# Altium project Artus Flex PCB - Revision 1.PrjPCB
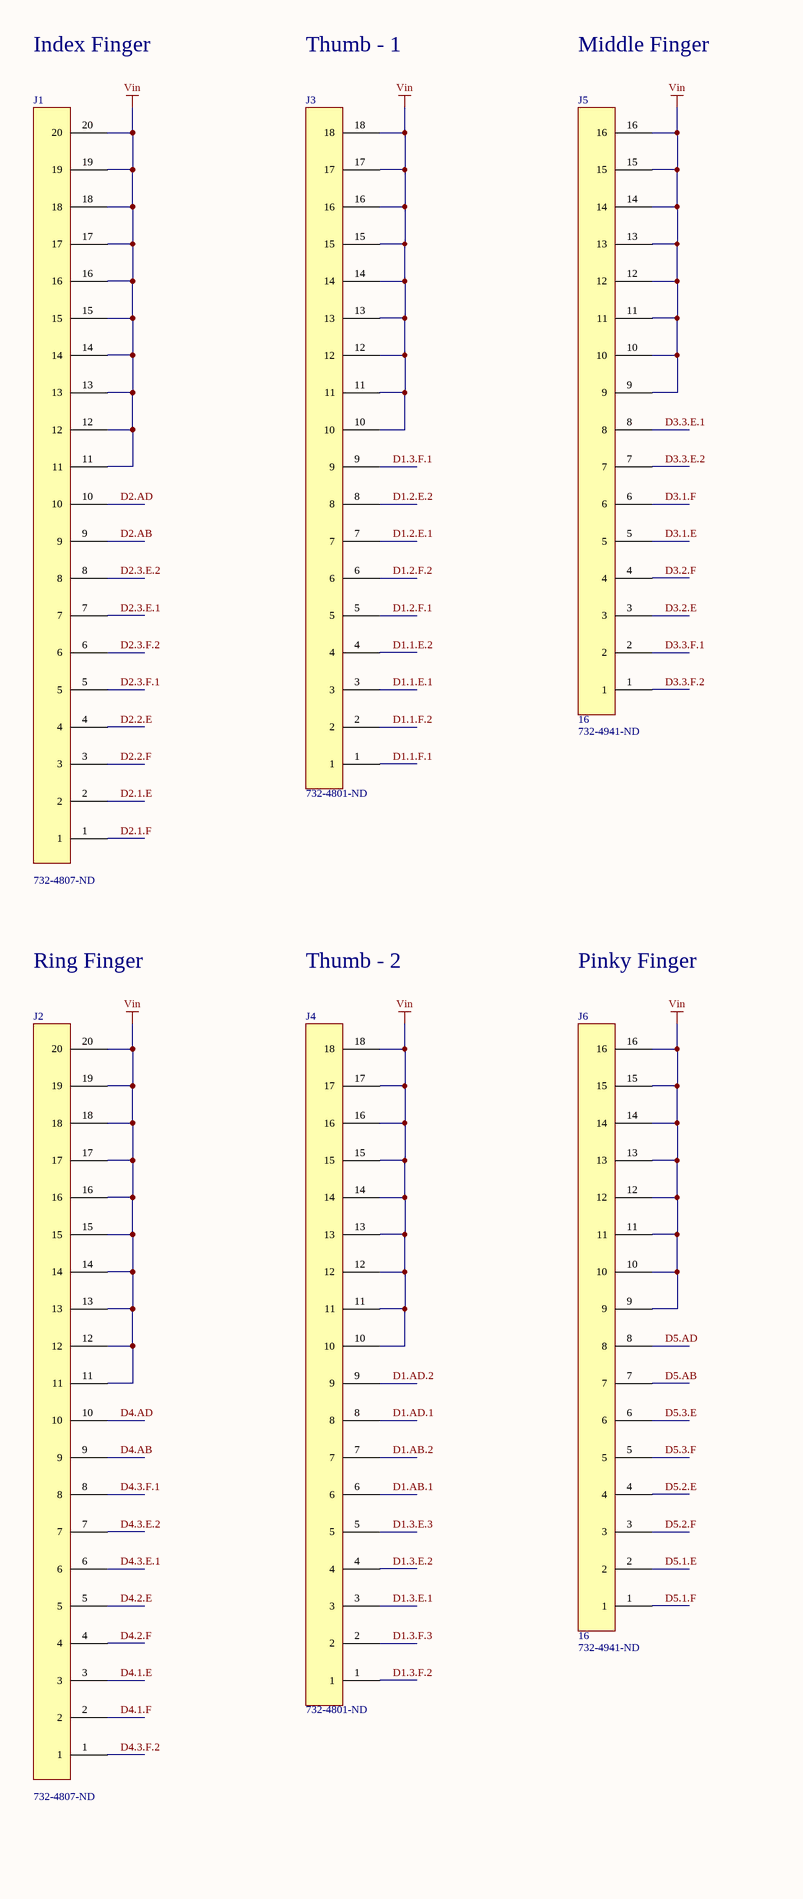
[diagram p0: FLEX_MCU_CONFIG.SchDoc, left]
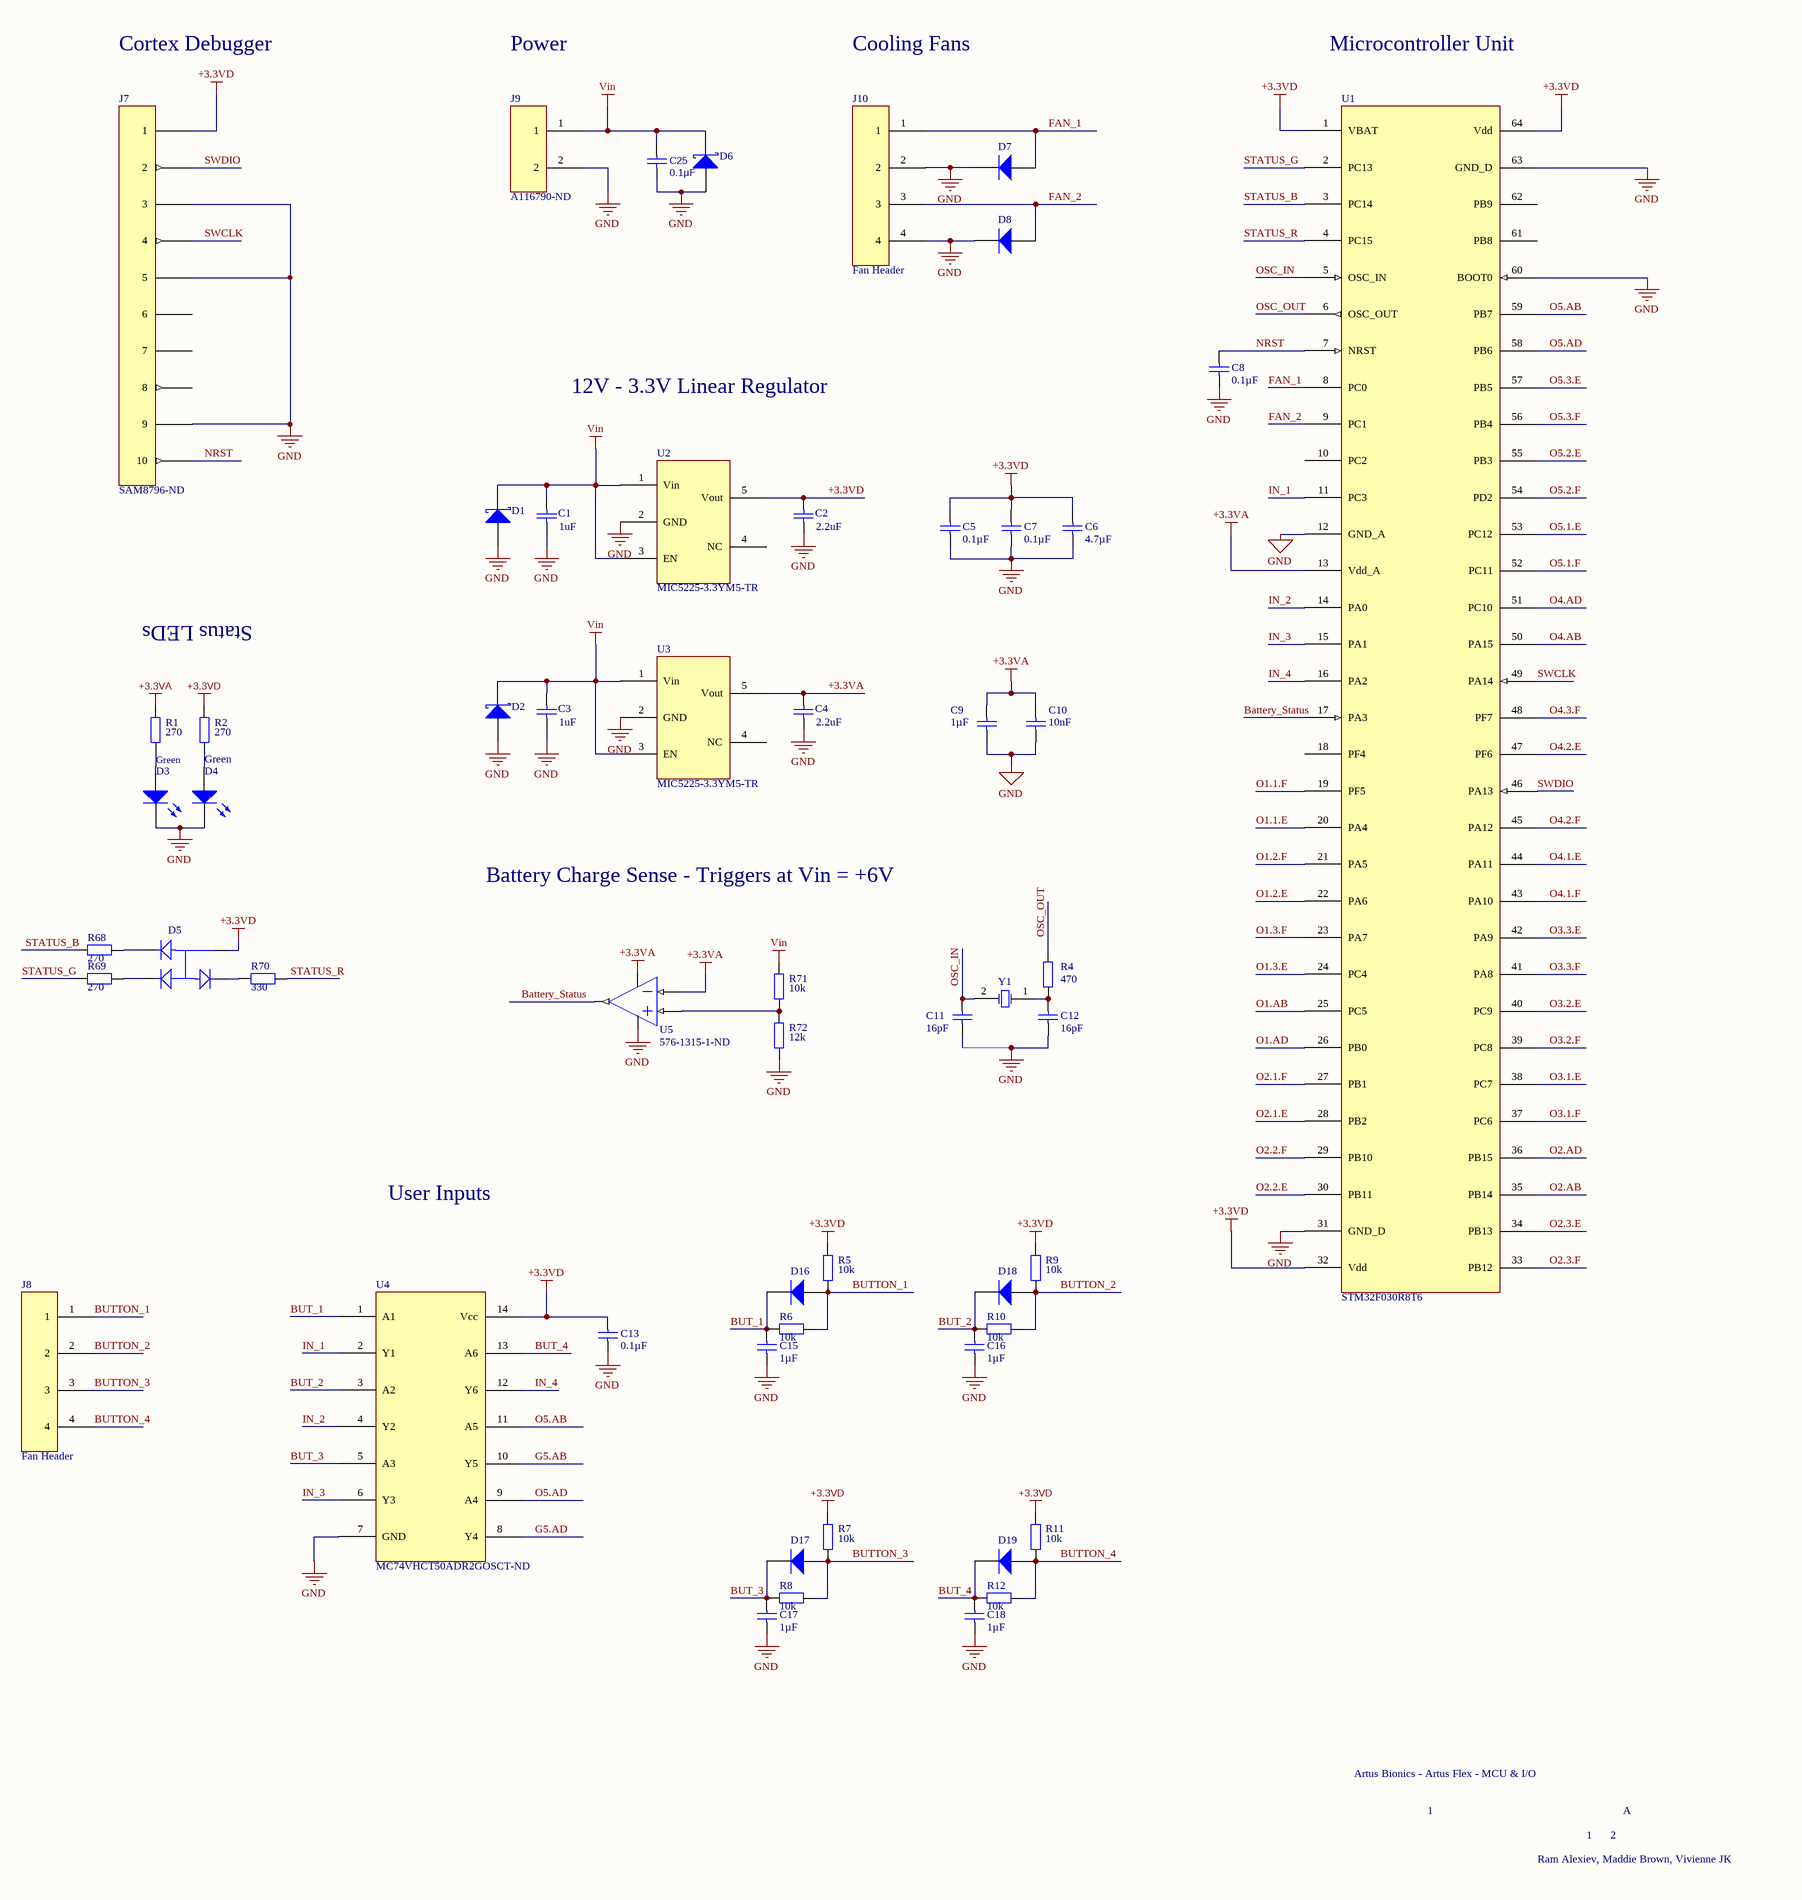
[diagram p1: FLEX_MCU_CONFIG.SchDoc, right]
2 sheets, 236 parts. Net scope: global (net labels, ports and power ports of the same name join across sheets).
Board file: PCB Layout.PcbDoc
Sheets:
  FLEX_MCU_CONFIG.SchDoc
  FLEX_OUTPUT.SchDoc

## Sheet FLEX_MCU_CONFIG.SchDoc
size A2; PageSetup: Record=PageOptions|CenterHorizontal=True|CenterVertical=True|PrintScale=0.69|XCorrection=1.00|YCorrection=1.00|PrintKind=0|BorderSize=5000000|LeftOffset=0|BottomOffset=0|Orientation=2|PaperLength=1000|PaperWidth=1000|Scale=100|PaperSource=7|PrintQuality=-3|MediaType=1|DitherType=10|PrintScaleMode=1|PaperKind=Tabloid|PaperIndex=3

### Parts
C1  value 1uF  [TDK C-Series (1608)]
C2  value 2.2uF  [TDK C-Series (1608)]
C3  value 1uF  [TDK C-Series (1608)]
C4  value 2.2uF  [TDK C-Series (1608)]
C5  value 0.1µF  [TDK C-Series (1608)]
C6  value 4.7µF  [TDK C-Series (1608)]  (hidden comment: Cap)
C7  value 0.1µF  [TDK C-Series (1608)]
C8  value 0.1µF  [TDK C-Series (1608)]
C9  value 1µF  [TDK C-Series (1608)]
C10  value 10nF  [TDK C-Series (1608)]
C11  value 16pF  [Johanson S-Series (1608)]
C12  value 16pF  [Johanson S-Series (1608)]
C13  value 0.1µF  [TDK C-Series (1608)]  (hidden comment: Cap)
C15  value 1µF  [TDK C-Series (1608)]  (hidden comment: Cap)
C16  value 1µF  [TDK C-Series (1608)]  (hidden comment: Cap)
C17  value 1µF  [TDK C-Series (1608)]  (hidden comment: Cap)
C18  value 1µF  [TDK C-Series (1608)]  (hidden comment: Cap)
C25  value 0.1µF  [TDK C-Series (1608)]
D1  (no value)  [Diode_TVS]
D2  (no value)  [Diode_TVS]
D3  LTST-C193KGKT-5A  [Lite-On LTST-C193K-Series (1608)]  (value not drawn)
D4  LTST-C193KGKT-5A  [Lite-On LTST-C193K-Series (1608)]  (value not drawn)
D5  Cree CLVBA-FKA-CAEDH8BBB7A363  [Cree CLVBA-FKA-Series (4-SOJ)]  (value not drawn)
D6  Diode BAT17  [Diode_TVS]  (value not drawn)
D7  Diode 1N4006  [Diode_Shottky]  (value not drawn)
D8  Diode 1N4006  [Diode_Shottky]  (value not drawn)
D16  de  [Diode_Shottky]  (value not drawn)
D17  de  [Diode_Shottky]  (value not drawn)
D18  de  [Diode_Shottky]  (value not drawn)
D19  de  [Diode_Shottky]  (value not drawn)
J1  Supplier Part Number 1: 732-4807-ND  [20PIN_UP_CONNECTOR]  (hidden comment: 20 Pin Header)
J2  Supplier Part Number 1: 732-4807-ND  [20PIN_UP_CONNECTOR]  (hidden comment: 20 Pin Header)
J3  Supplier Part Number 1: 732-4801-ND  [18PIN_UP_CONNECTOR]  (hidden comment: 18 Pin Header)
J4  Supplier Part Number 1: 732-4801-ND  [18PIN_UP_CONNECTOR]  (hidden comment: 18 Pin Header)
J5  16  Supplier Part Number 1: 732-4941-ND
J6  16  Supplier Part Number 1: 732-4941-ND
J7  Supplier Part Number 2: SAM8796-ND  [Samtec FTSH-105-01-L-DV-K]  (hidden comment: Cortex Debugger)
J8  Fan Header
J9  Supplier Part Number 1: A116790-ND  [2PIN_TERMINAL_BLOCK]  (hidden comment: Power Header)
J10  Fan Header
R1  value 270  [Panasonic ERJ-Series (1608)]
R2  value 270  [Panasonic ERJ-Series (1608)]
R4  value 470  [Panasonic ERJ-Series (1608)]
R5  value 10k  [Panasonic ERJ-Series (1608)]
R6  value 10k  [Panasonic ERJ-Series (1608)]
R7  value 10k  [Panasonic ERJ-Series (1608)]
R8  value 10k  [Panasonic ERJ-Series (1608)]
R9  value 10k  [Panasonic ERJ-Series (1608)]
R10  value 10k  [Panasonic ERJ-Series (1608)]
R11  value 10k  [Panasonic ERJ-Series (1608)]
R12  value 10k  [Panasonic ERJ-Series (1608)]
R68  value 270  [Panasonic ERJ-Series (1608)]
R69  value 270  [Panasonic ERJ-Series (1608)]
R70  value 330  [Panasonic ERJ-Series (1608)]
R71  value 10k  [Panasonic ERJ-Series (1608)]
R72  value 12k  [Panasonic ERJ-Series (1608)]
U1  STM32F030R8T6
U2  MIC5225-3.3YM5-TR  [LINEAR REGULATOR SOT95P280X145-5N]
U3  MIC5225-3.3YM5-TR  [LINEAR REGULATOR SOT95P280X145-5N]
U4  Supplier Part Number 1: MC74VHCT50ADR2GOSCT-ND  (hidden comment: MC74VHCT50A)
U5  Supplier Part Number 1: 576-1315-1-ND  [LINEAR REGULATOR SOT95P280X145-5N]  (hidden comment: TSV991ILT)
Y1  (no value)  [Abracon ABM3-8.000MHZ-D2Y-T (2-DFN)]

### Nets
+3.3VA: C4.2 C9.2 C10.2 R1.2 U1.13(Vdd_A) U3.5(Vout) U5.2(VCC-) U5.4(IN-)
+3.3VD: C2.2 C5.2 C6.2 C7.2 C13.2 D5.2(COMMON_ANODE) J7.1 R2.2 R5.1 R7.1 R9.1 R11.1 U1.1(VBAT) U1.32(Vdd) U1.64(Vdd) U2.5(Vout) U4.14(Vcc)
GND: C1.1 C2.1 C3.1 C4.1 C5.1 C6.1 C7.1 C8.1 C9.1 C10.1 C11.2 C12.2 C13.1 C15.1 C16.1 C17.1 C18.1 C25.1 D1.3(A) D2.3(A) D3.2(K) D4.2(K) D6.1(A) D7.2(K) D8.2(K) J7.3 J7.5 J7.9 J9.2 J10.2 J10.4 R72.2 U1.12(GND_A) U1.31(GND_D) U1.60(BOOT0) U1.63(GND_D) U2.2(GND) U3.2(GND) U4.7(GND) U5.5(VCC+)
Vin: C1.2 C3.2 C25.2 D1.1(K) D2.1(K) D6.3(K) J1.11 J1.12 J1.13 J1.14 J1.15 J1.16 J1.17 J1.18 J1.19 J1.20 J2.11 J2.12 J2.13 J2.14 J2.15 J2.16 J2.17 J2.18 J2.19 J2.20 J3.10 J3.11 J3.12 J3.13 J3.14 J3.15 J3.16 J3.17 J3.18 J4.10 J4.11 J4.12 J4.13 J4.14 J4.15 J4.16 J4.17 J4.18 J5.9 J5.10 J5.11 J5.12 J5.13 J5.14 J5.15 J5.16 J6.9 J6.10 J6.11 J6.12 J6.13 J6.14 J6.15 J6.16 J9.1 R71.1 U2.1(Vin) U2.3(EN) U3.1(Vin) U3.3(EN)
Battery_Status: U1.17(PA3) U5.1(OUT)
BUT_1: C15.2 D16.2(K) R6.1 U4.1(A1)
BUT_2: C16.2 D18.2(K) R10.1 U4.3(A2)
BUT_3: C17.2 D17.2(K) R8.1 U4.5(A3)
BUT_4: C18.2 D19.2(K) R12.1 U4.13(A6)
BUTTON_1: D16.1(A) J8.1 R5.2 R6.2
BUTTON_2: D18.1(A) J8.2 R9.2 R10.2
BUTTON_3: D17.1(A) J8.3 R7.2 R8.2
BUTTON_4: D19.1(A) J8.4 R11.2 R12.2
D1.1.E.1: J3.3
D1.1.E.2: J3.4
D1.1.F.1: J3.1
D1.1.F.2: J3.2
D1.2.E.1: J3.7
D1.2.E.2: J3.8
D1.2.F.1: J3.5
D1.2.F.2: J3.6
D1.3.E.1: J4.3
D1.3.E.2: J4.4
D1.3.E.3: J4.5
D1.3.F.1: J3.9
D1.3.F.2: J4.1
D1.3.F.3: J4.2
D1.AB.1: J4.6
D1.AB.2: J4.7
D1.AD.1: J4.8
D1.AD.2: J4.9
D2.1.E: J1.2
D2.1.F: J1.1
D2.2.E: J1.4
D2.2.F: J1.3
D2.3.E.1: J1.7
D2.3.E.2: J1.8
D2.3.F.1: J1.5
D2.3.F.2: J1.6
D2.AB: J1.9
D2.AD: J1.10
D3.1.E: J5.5
D3.1.F: J5.6
D3.2.E: J5.3
D3.2.F: J5.4
D3.3.E.1: J5.8
D3.3.E.2: J5.7
D3.3.F.1: J5.2
D3.3.F.2: J5.1
D4.1.E: J2.3
D4.1.F: J2.2
D4.2.E: J2.5
D4.2.F: J2.4
D4.3.E.1: J2.6
D4.3.E.2: J2.7
D4.3.F.1: J2.8
D4.3.F.2: J2.1
D4.AB: J2.9
D4.AD: J2.10
D5.1.E: J6.2
D5.1.F: J6.1
D5.2.E: J6.4
D5.2.F: J6.3
D5.3.E: J6.6
D5.3.F: J6.5
D5.AB: J6.7
D5.AD: J6.8
FAN_1: D7.1(A) J10.1 U1.8(PC0)
FAN_2: D8.1(A) J10.3 U1.9(PC1)
G5.AB: U4.10(Y5)
G5.AD: U4.8(Y4)
IN_1: U1.11(PC3) U4.2(Y1)
IN_2: U1.14(PA0) U4.4(Y2)
IN_3: U1.15(PA1) U4.6(Y3)
IN_4: U1.16(PA2) U4.12(Y6)
NRST: C8.2 J7.10 U1.7(NRST)
O1.1.E: U1.20(PA4)
O1.1.F: U1.19(PF5)
O1.2.E: U1.22(PA6)
O1.2.F: U1.21(PA5)
O1.3.E: U1.24(PC4)
O1.3.F: U1.23(PA7)
O1.AB: U1.25(PC5)
O1.AD: U1.26(PB0)
O2.1.E: U1.28(PB2)
O2.1.F: U1.27(PB1)
O2.2.E: U1.30(PB11)
O2.2.F: U1.29(PB10)
O2.3.E: U1.34(PB13)
O2.3.F: U1.33(PB12)
O2.AB: U1.35(PB14)
O2.AD: U1.36(PB15)
O3.1.E: U1.38(PC7)
O3.1.F: U1.37(PC6)
O3.2.E: U1.40(PC9)
O3.2.F: U1.39(PC8)
O3.3.E: U1.42(PA9)
O3.3.F: U1.41(PA8)
O4.1.E: U1.44(PA11)
O4.1.F: U1.43(PA10)
O4.2.E: U1.47(PF6)
O4.2.F: U1.45(PA12)
O4.3.F: U1.48(PF7)
O4.AB: U1.50(PA15)
O4.AD: U1.51(PC10)
O5.1.E: U1.53(PC12)
O5.1.F: U1.52(PC11)
O5.2.E: U1.55(PB3)
O5.2.F: U1.54(PD2)
O5.3.E: U1.57(PB5)
O5.3.F: U1.56(PB4)
O5.AB: U1.59(PB7) U4.11(A5)
O5.AD: U1.58(PB6) U4.9(A4)
OSC_IN: C11.1 U1.5(OSC_IN) Y1.2(OSC2)
OSC_OUT: R4.2 U1.6(OSC_OUT)
STATUS_B: R68.1 U1.3(PC14)
STATUS_G: R69.1 U1.2(PC13)
STATUS_R: R70.2 U1.4(PC15)
SWCLK: J7.4 U1.49(PA14)
SWDIO: J7.66(2) U1.46(PA13)
NetC12_1: C12.1 R4.1 Y1.1(OSC1)
NetD3_1: D3.1(A) R1.1
NetD4_1: D4.1(A) R2.1
NetD5_1: D5.1(RED) R70.1
NetD5_3: D5.3(BLUE) R68.2
NetD5_4: D5.4(GREEN) R69.2
NetR71_2: R71.2 R72.1 U5.3(IN+)

Not connected (* = marked no-connect by the designer): J7 6 7 8; U1 10(PC2) 18(PF4) 61(PB8) 62(PB9); U2 4(NC); U3 4(NC)

### Notes on the sheet
- Index Finger
- Thumb - 1
- Middle Finger
- Cortex Debugger
- Power
- Cooling Fans
- Microcontroller Unit
- 12V - 3.3V Linear Regulator
- Status LEDs
- (near R1) Green
- (near R2) Green
- Battery Charge Sense - Triggers at Vin = +6V
- Ring Finger
- Thumb - 2
- Pinky Finger
- User Inputs
- Artus Bionics - Artus Flex - MCU & I/O
- 1
- 2
- A
- Ram Alexiev, Maddie Brown, Vivienne JK

### Library data of the parts
C1-C13 C15-C18 C25 = Cap: Capacitor; Published: 8-Jun-2000; LatestRevisionDate: 17-Jul-2002; LatestRevisionNote: Re-released for DXP Platform.; PackageReference: RAD-0.3; Publisher: Altium Limited; PackageDescription: Radial Cap, Thru-Hole; 2 Leads; 0.3 in Pin Spacing; Supplier 1: Digi-Key
  C1 C3: Supplier 2: Digi-Key; Supplier Part Number 2: 445-5146-1-ND
  C2 C4: Supplier 2: Digi-Key; Supplier Part Number 2: 445-5964-1-ND
  C5 C7 C8 C13 C25: Supplier Part Number 1: 445-1316-1-ND
  C6: Supplier Part Number 1: 445-7482-1-ND
  C9: Supplier Part Number 1: 445-5956-1-ND
  C10: Supplier Part Number 1: 445-1304-1-ND
  C11 C12: Supplier Part Number 1: 712-1320-1-ND
  C15-C18: Supplier Part Number 1: 445-5146-1-ND
D1 D2 = Diode 10TQ035: Schottky Rectifier; Note: Terminal 2 is the TAB and is electrically connected to the cathode; Published: 8-Jun-2000; LatestRevisionDate: 17-Jul-2002; LatestRevisionNote: Re-released for DXP Platform.; DatasheetVersion: PD-2.057B; PackageVersion: Feb-1998; PackageReference: TO-220AC; Publisher: Altium Limited; PackageDescription: TO, Thru-Hole, Vertical, Heatsink Mounted; 3 In-Line Leads (1 Absent); Pitch 2.54 mm; ComponentLink1Description: Manufacturer Link; ComponentLink1URL: http://www.irf.com/; ComponentLink2Description: Datasheet; ComponentLink2URL: http://www.irf.com/product-info/datasheets/data/10tq.pdf; Supplier 1: Digi-Key; Supplier 2: Digi-Key; Supplier Part Number 2: SMBJ8.0D-M3/HGICT-ND
D3 D4 = LED0: Typical INFRARED GaAs LED; Published: 8-Jun-2000; LatestRevisionDate: 08-Jul-2005; LatestRevisionNote: Mech Layer 1 removed.; PackageReference: LED-0; Publisher: Altium Limited; PackageDescription: LED; 2 Leads; Supplier 1: Digi-Key; Supplier Part Number 1: 160-1828-1-ND
D5 = Cree CLVBA-FKA-CAEDH8BBB7A363: RGB LED; Supplier 1: Digi-Key; Supplier Part Number 1: CLVBA-FKA-CAEDH8BBB7A363CT-ND
D6 = Diode BAT17: Silicon RF Schottky Diode for Mixer Applications in the VHF/UHF Range; Note: Pin 2 is not connected and not drawn.; Published: 21-Mar-2003; LatestRevisionDate: 29-May-2009; LatestRevisionNote: IPC-7351 Footprint Added.; DatasheetVersion: Oct-1999; PackageVersion: Sep-2001; PackageReference: SOT-23; Publisher: Altium Limited; PackageDescription: 3-Pin SOT-23 Package 0.95 mm Pitch, 2.5 mm Lead Span; ComponentLink1Description: Manufacturer Link; ComponentLink1URL: http://www.infineon.com/; ComponentLink2Description: Datasheet; ComponentLink2URL: http://www.infineon.com/upload/Document/cmc_upload/documents/009/363/bat17series.pdf; Supplier 1: Digi-Key; Supplier Part Number 1: DF2S10FSL3MCT-ND
D7 D8 = Diode 1N4006: 1 Amp General Purpose Rectifier; Published: 8-Jun-2000; LatestRevisionDate: 17-Jul-2002; LatestRevisionNote: Re-released for DXP Platform.; DatasheetVersion: 1998; PackageVersion: Aug-1999; PackageReference: DO-41; Publisher: Altium Limited; PackageDescription: Diode, Axial; Body 5.2 x 2.7 mm (LxDia. max), Lead Dia. 0.86 mm (max); Code_JEDEC: DO-204-AL; ComponentLink1Description: Manufacturer Link; ComponentLink1URL: http://www.fairchildsemi.com/; ComponentLink2Description: Datasheet; ComponentLink2URL: http://www.fairchildsemi.com/ds/1N%2F1N4001.pdf; Supplier 1: Digi-Key; Supplier Part Number 1: 1655-1502-1-ND
D16-D19 = Diode: Default Diode; Published: 8-Jun-2000; LatestRevisionDate: 17-Jul-2002; LatestRevisionNote: Re-released for DXP Platform.; PackageVersion: Sep-1996; PackageReference: SMC; Publisher: Altium Limited; PackageDescription: DO-214-AB/SMC; 2 C-Bend Leads; Body 7.9 x 5.9 mm, inc. leads (LxW); Code_JEDEC: DO-214-AB; Supplier 1: Digi-Key; Supplier Part Number 1: 1727-5384-1-ND
J1 J2 = 20 Pin Header: 20 position header; Supplier 1: Digi-Key
J3 J4 = 18 Pin Header: 18 Position Header; Supplier 1: Digi-Key
J5 J6 = 16: 16 Position header; Supplier 1: Digi-Key
J7 = Cortex Debugger: Header; Supplier 1: Digi-Key; Supplier 2: Digi-Key
R1 R2 R4-R12 R68-R72 = Res2: Resistor; Published: 8-Jun-2000; LatestRevisionDate: 17-Jul-2002; LatestRevisionNote: Re-released for DXP Platform.; PackageReference: AXIAL-0.4; Publisher: Altium Limited; PackageDescription: Axial Device, Thru-Hole; 2 Leads; 0.4 in Pin Spacing; Supplier 1: Digi-Key
  R1 R2 R68 R69: Supplier Part Number 1: P270HCT-ND
  R4: Supplier Part Number 1: P470HCT-ND
  R5-R12 R71: Supplier Part Number 1: P10.0KHCT-ND
  R70: Supplier Part Number 1: P330HCT-ND
  R72: Supplier Part Number 1: P12.0KHCT-ND
U1 = STM32F030R8T6: MCU; Supplier Part Number 1: 497-14045-ND; Supplier 1: Digi-Key
U2 U3 = MIC5225-3.3YM5-TR: 12V-3.3V Linear Regulator; Supplier 1: Digi-Key; Supplier Part Number 1: 576-2980-1-ND
U4 = MC74VHCT50A: 6-Channel CMOS Buffer; Supplier 1: Digi-Key
U5 = STMicroelectronics TSV991ILT: 20MHz Op-Amp; Supplier 1: Digi-Key
Y1 = XTAL: Crystal Oscillator; Published: 8-Jun-2000; LatestRevisionDate: 17-Jul-2002; LatestRevisionNote: Re-released for DXP Platform.; PackageReference: R38; Publisher: Altium Limited; PackageDescription: Crystal, Thru-Hole; 2 Leads; Body 3.1 x 8.2 mm (Dia.xH); Supplier 1: Digi-Key; Supplier Part Number 1: 535-10630-1-ND
J8 J10 = Fan Header: Supplier 1: Digi-Key; Supplier Part Number 1: A33201CT-ND
J9 = Power Header: Supplier 1: Digi-Key

## Sheet FLEX_OUTPUT.SchDoc
size A2; PageSetup: Record=PageOptions|CenterHorizontal=True|CenterVertical=True|PrintScale=0.52|XCorrection=1.00|YCorrection=1.00|PrintKind=0|BorderSize=5000000|LeftOffset=0|BottomOffset=0|Orientation=2|PaperLength=1000|PaperWidth=1000|Scale=100|PaperSource=7|PrintQuality=-3|MediaType=1|DitherType=10|PrintScaleMode=1|PaperKind=A4|PaperIndex=9
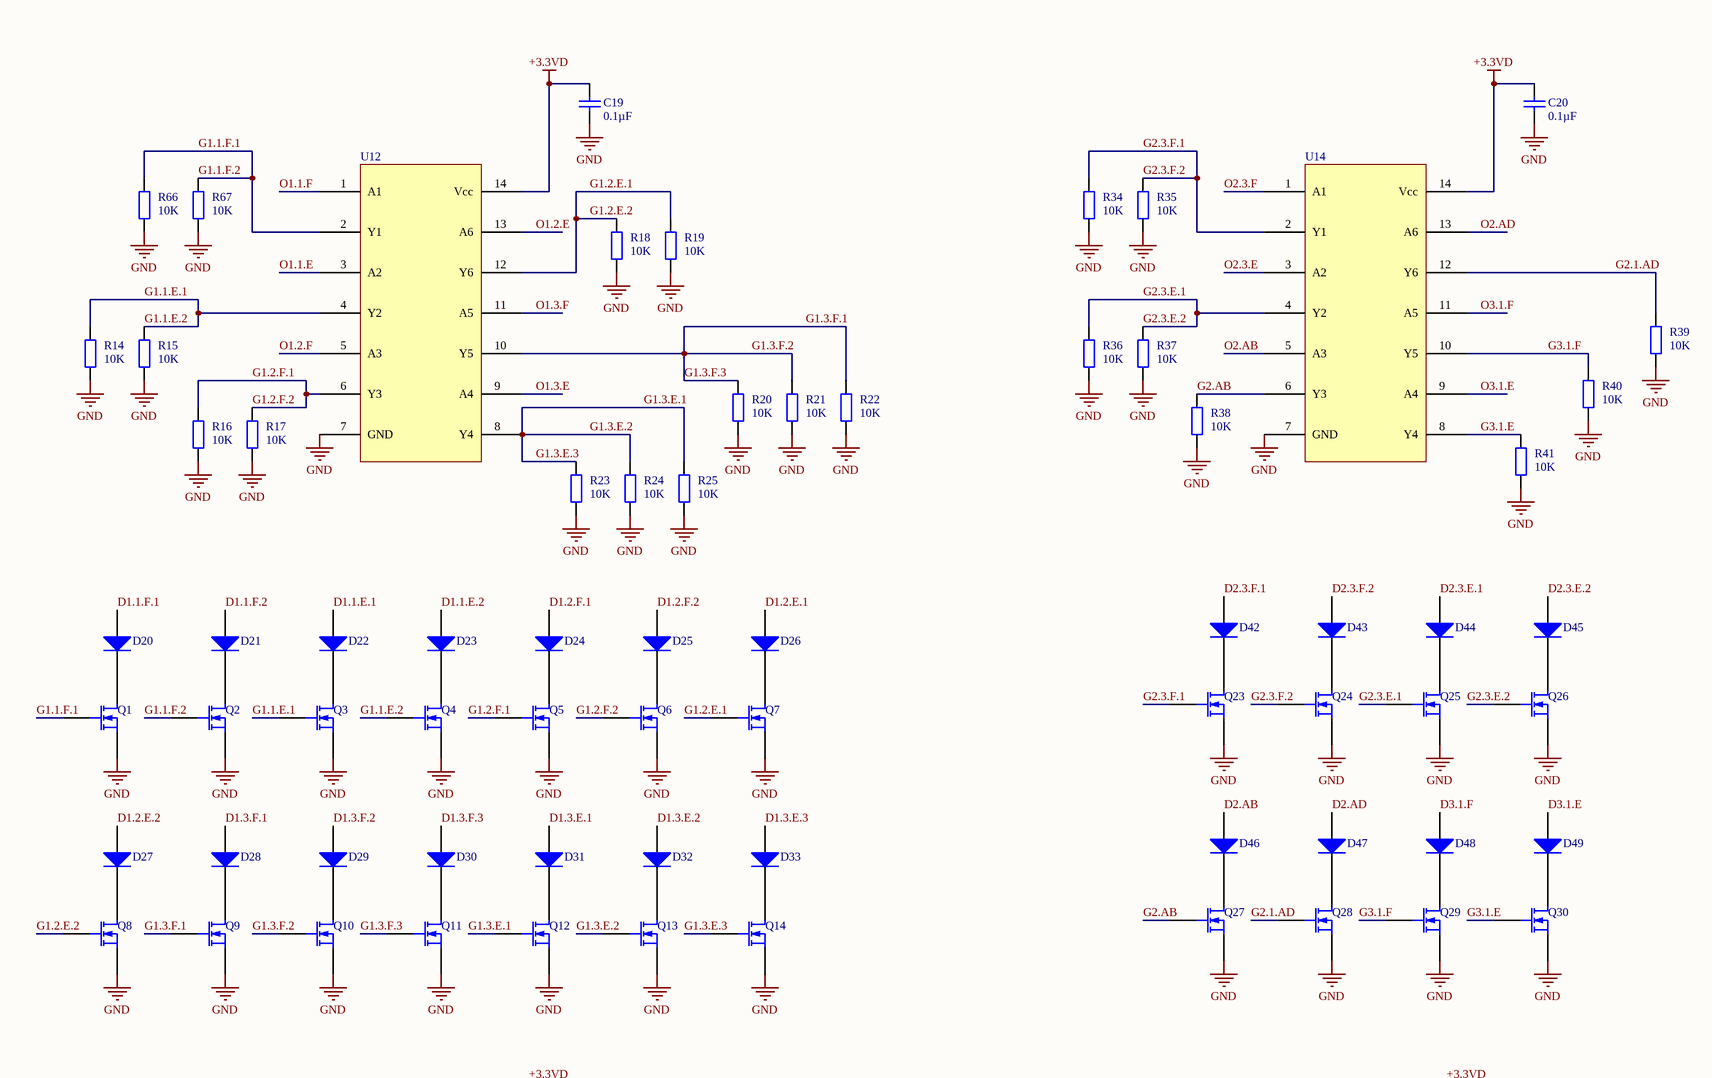
[diagram p2: FLEX_OUTPUT.SchDoc, top left]
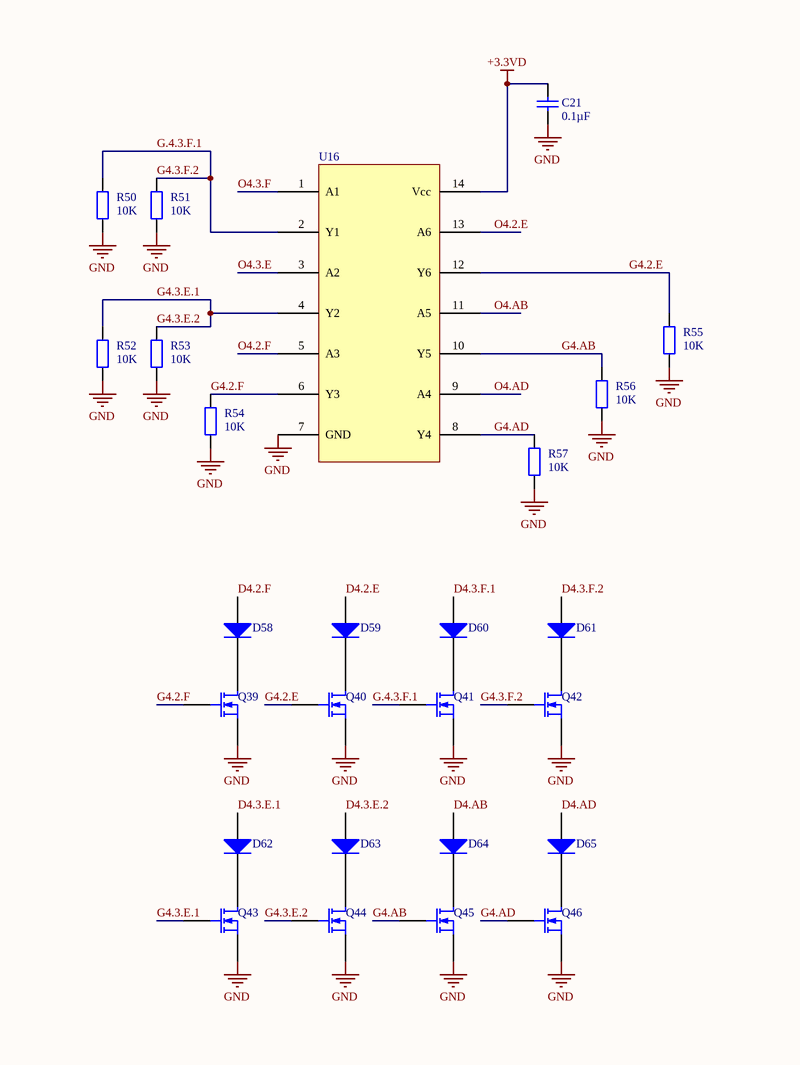
[diagram p3: FLEX_OUTPUT.SchDoc, top right]
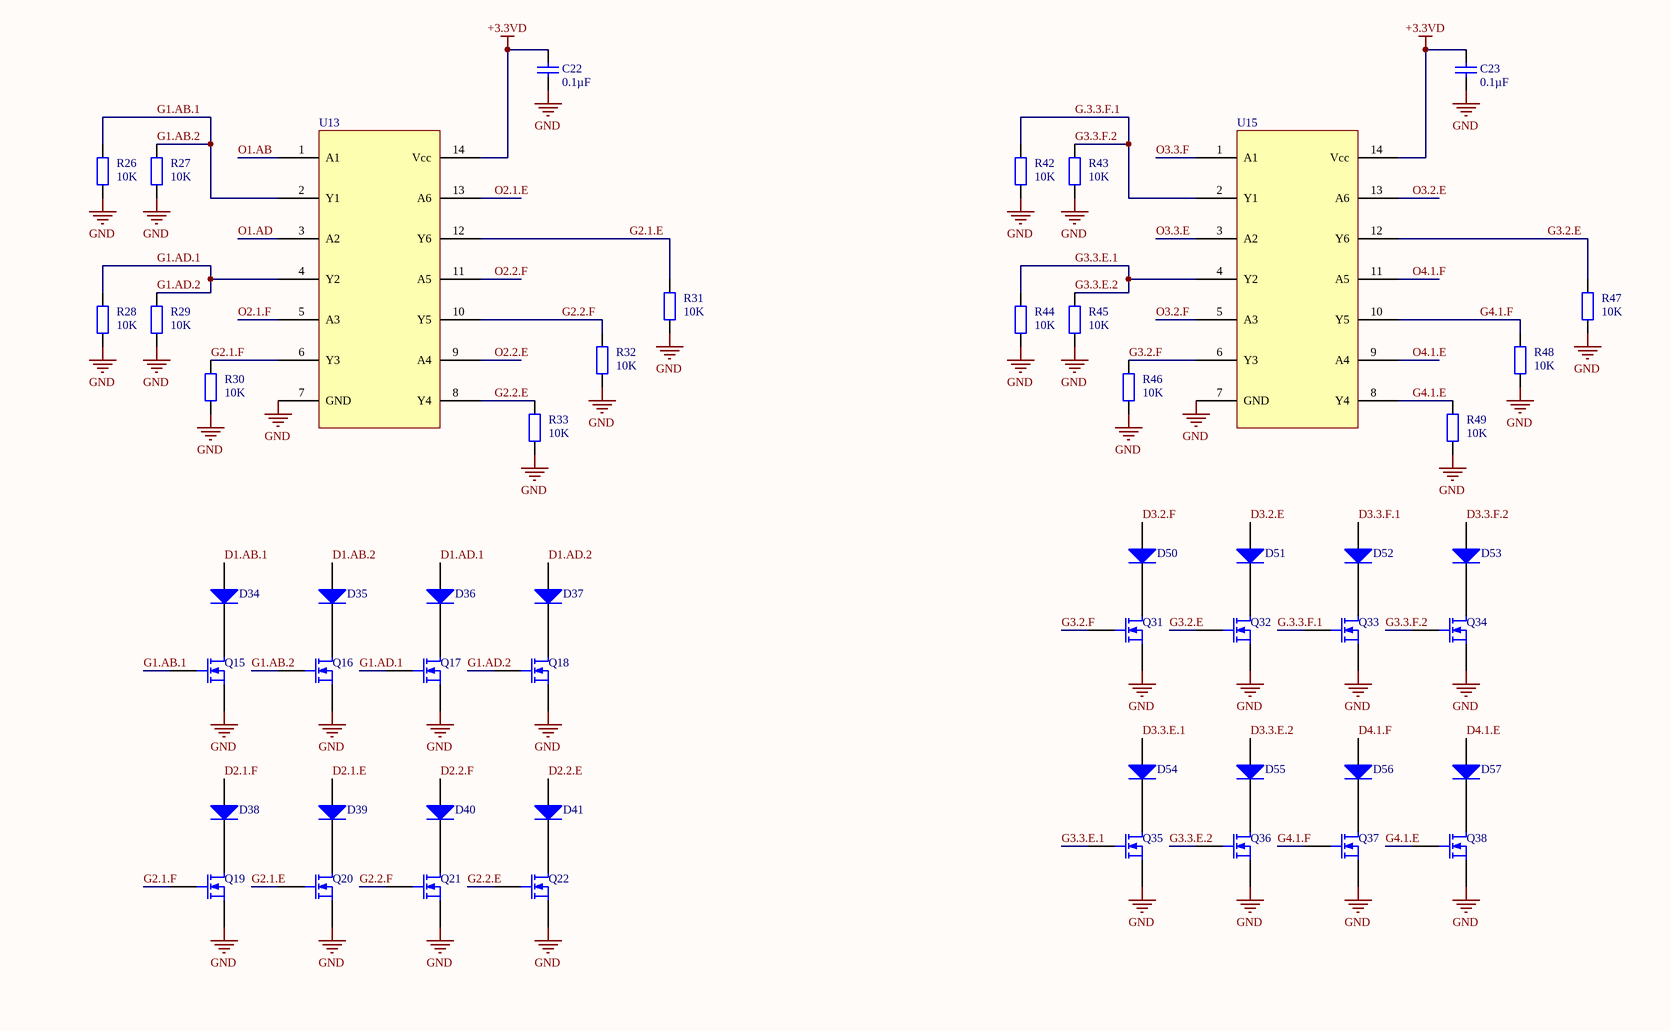
[diagram p4: FLEX_OUTPUT.SchDoc, bottom left]
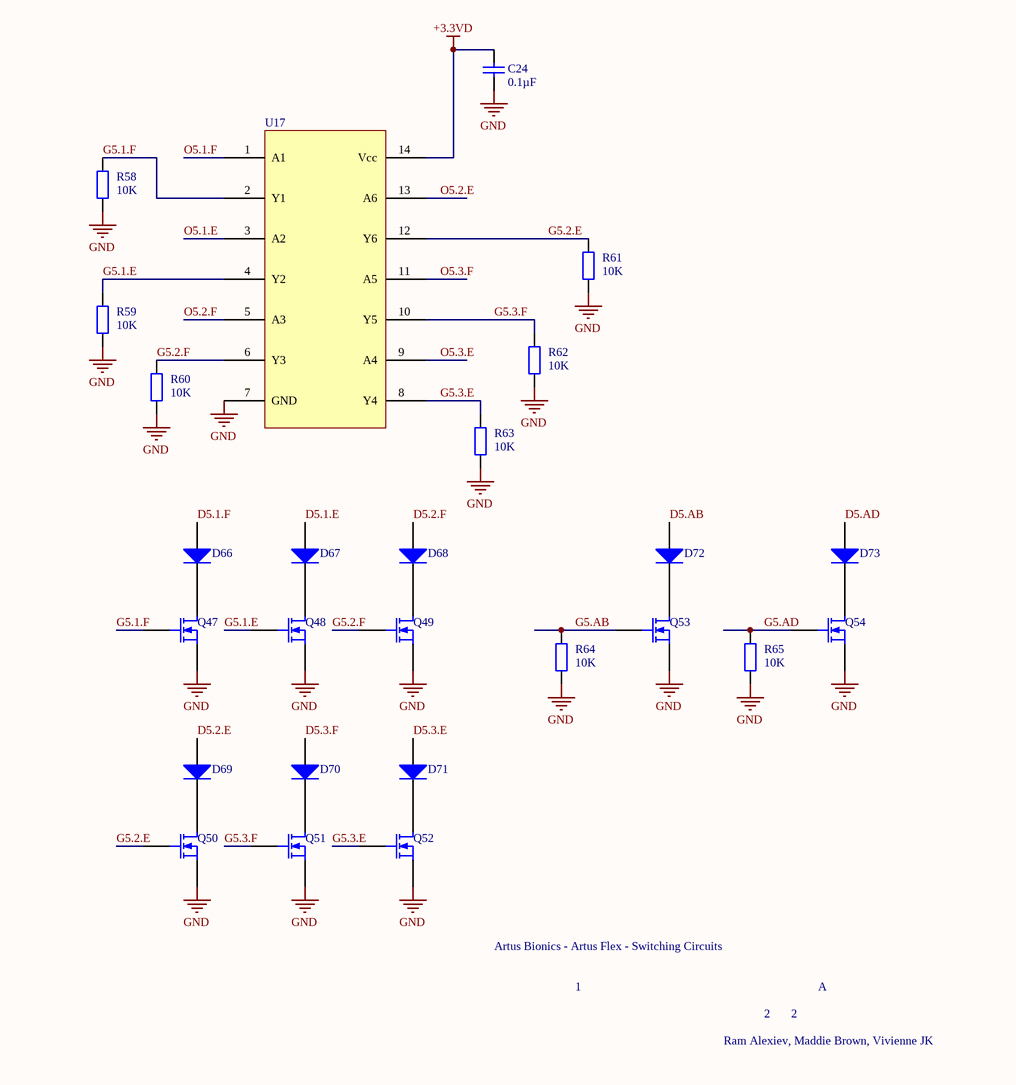
[diagram p5: FLEX_OUTPUT.SchDoc, bottom right]

### Parts
C19  value 0.1µF  [TDK C-Series (1608)]  (hidden comment: Cap)
C20  value 0.1µF  [TDK C-Series (1608)]  (hidden comment: Cap)
C21  value 0.1µF  [TDK C-Series (1608)]  (hidden comment: Cap)
C22  value 0.1µF  [TDK C-Series (1608)]  (hidden comment: Cap)
C23  value 0.1µF  [TDK C-Series (1608)]  (hidden comment: Cap)
C24  value 0.1µF  [TDK C-Series (1608)]  (hidden comment: Cap)
D20  de  [Diode_Shottky]  (value not drawn)
D21  de  [Diode_Shottky]  (value not drawn)
D22  de  [Diode_Shottky]  (value not drawn)
D23  de  [Diode_Shottky]  (value not drawn)
D24  de  [Diode_Shottky]  (value not drawn)
D25  de  [Diode_Shottky]  (value not drawn)
D26  de  [Diode_Shottky]  (value not drawn)
D27  de  [Diode_Shottky]  (value not drawn)
D28  de  [Diode_Shottky]  (value not drawn)
D29  de  [Diode_Shottky]  (value not drawn)
D30  de  [Diode_Shottky]  (value not drawn)
D31  de  [Diode_Shottky]  (value not drawn)
D32  de  [Diode_Shottky]  (value not drawn)
D33  de  [Diode_Shottky]  (value not drawn)
D34  de  [Diode_Shottky]  (value not drawn)
D35  de  [Diode_Shottky]  (value not drawn)
D36  de  [Diode_Shottky]  (value not drawn)
D37  de  [Diode_Shottky]  (value not drawn)
D38  de  [Diode_Shottky]  (value not drawn)
D39  de  [Diode_Shottky]  (value not drawn)
D40  de  [Diode_Shottky]  (value not drawn)
D41  de  [Diode_Shottky]  (value not drawn)
D42  de  [Diode_Shottky]  (value not drawn)
D43  de  [Diode_Shottky]  (value not drawn)
D44  de  [Diode_Shottky]  (value not drawn)
D45  de  [Diode_Shottky]  (value not drawn)
D46  de  [Diode_Shottky]  (value not drawn)
D47  de  [Diode_Shottky]  (value not drawn)
D48  de  [Diode_Shottky]  (value not drawn)
D49  de  [Diode_Shottky]  (value not drawn)
D50  de  [Diode_Shottky]  (value not drawn)
D51  de  [Diode_Shottky]  (value not drawn)
D52  de  [Diode_Shottky]  (value not drawn)
D53  de  [Diode_Shottky]  (value not drawn)
D54  de  [Diode_Shottky]  (value not drawn)
D55  de  [Diode_Shottky]  (value not drawn)
D56  de  [Diode_Shottky]  (value not drawn)
D57  de  [Diode_Shottky]  (value not drawn)
D58  de  [Diode_Shottky]  (value not drawn)
D59  de  [Diode_Shottky]  (value not drawn)
D60  de  [Diode_Shottky]  (value not drawn)
D61  de  [Diode_Shottky]  (value not drawn)
D62  de  [Diode_Shottky]  (value not drawn)
D63  de  [Diode_Shottky]  (value not drawn)
D64  de  [Diode_Shottky]  (value not drawn)
D65  de  [Diode_Shottky]  (value not drawn)
D66  de  [Diode_Shottky]  (value not drawn)
D67  de  [Diode_Shottky]  (value not drawn)
D68  de  [Diode_Shottky]  (value not drawn)
D69  de  [Diode_Shottky]  (value not drawn)
D70  de  [Diode_Shottky]  (value not drawn)
D71  de  [Diode_Shottky]  (value not drawn)
D72  de  [Diode_Shottky]  (value not drawn)
D73  de  [Diode_Shottky]  (value not drawn)
Q1  (no value)  [MOSFET SOT90P236X110-3N]
Q2  (no value)  [MOSFET SOT90P236X110-3N]
Q3  (no value)  [MOSFET SOT90P236X110-3N]
Q4  (no value)  [MOSFET SOT90P236X110-3N]
Q5  (no value)  [MOSFET SOT90P236X110-3N]
Q6  (no value)  [MOSFET SOT90P236X110-3N]
Q7  (no value)  [MOSFET SOT90P236X110-3N]
Q8  (no value)  [MOSFET SOT90P236X110-3N]
Q9  (no value)  [MOSFET SOT90P236X110-3N]
Q10  (no value)  [MOSFET SOT90P236X110-3N]
Q11  (no value)  [MOSFET SOT90P236X110-3N]
Q12  (no value)  [MOSFET SOT90P236X110-3N]
Q13  (no value)  [MOSFET SOT90P236X110-3N]
Q14  (no value)  [MOSFET SOT90P236X110-3N]
Q15  (no value)  [MOSFET SOT90P236X110-3N]
Q16  (no value)  [MOSFET SOT90P236X110-3N]
Q17  (no value)  [MOSFET SOT90P236X110-3N]
Q18  (no value)  [MOSFET SOT90P236X110-3N]
Q19  (no value)  [MOSFET SOT90P236X110-3N]
Q20  (no value)  [MOSFET SOT90P236X110-3N]
Q21  (no value)  [MOSFET SOT90P236X110-3N]
Q22  (no value)  [MOSFET SOT90P236X110-3N]
Q23  (no value)  [MOSFET SOT90P236X110-3N]
Q24  (no value)  [MOSFET SOT90P236X110-3N]
Q25  (no value)  [MOSFET SOT90P236X110-3N]
Q26  (no value)  [MOSFET SOT90P236X110-3N]
Q27  (no value)  [MOSFET SOT90P236X110-3N]
Q28  (no value)  [MOSFET SOT90P236X110-3N]
Q29  (no value)  [MOSFET SOT90P236X110-3N]
Q30  (no value)  [MOSFET SOT90P236X110-3N]
Q31  (no value)  [MOSFET SOT90P236X110-3N]
Q32  (no value)  [MOSFET SOT90P236X110-3N]
Q33  (no value)  [MOSFET SOT90P236X110-3N]
Q34  (no value)  [MOSFET SOT90P236X110-3N]
Q35  (no value)  [MOSFET SOT90P236X110-3N]
Q36  (no value)  [MOSFET SOT90P236X110-3N]
Q37  (no value)  [MOSFET SOT90P236X110-3N]
Q38  (no value)  [MOSFET SOT90P236X110-3N]
Q39  (no value)  [MOSFET SOT90P236X110-3N]
Q40  (no value)  [MOSFET SOT90P236X110-3N]
Q41  (no value)  [MOSFET SOT90P236X110-3N]
Q42  (no value)  [MOSFET SOT90P236X110-3N]
Q43  (no value)  [MOSFET SOT90P236X110-3N]
Q44  (no value)  [MOSFET SOT90P236X110-3N]
Q45  (no value)  [MOSFET SOT90P236X110-3N]
Q46  (no value)  [MOSFET SOT90P236X110-3N]
Q47  (no value)  [MOSFET SOT90P236X110-3N]
Q48  (no value)  [MOSFET SOT90P236X110-3N]
Q49  (no value)  [MOSFET SOT90P236X110-3N]
Q50  (no value)  [MOSFET SOT90P236X110-3N]
Q51  (no value)  [MOSFET SOT90P236X110-3N]
Q52  (no value)  [MOSFET SOT90P236X110-3N]
Q53  (no value)  [MOSFET SOT90P236X110-3N]
Q54  (no value)  [MOSFET SOT90P236X110-3N]
R14  value 10K  [Panasonic ERJ-Series (1608)]
R15  value 10K  [Panasonic ERJ-Series (1608)]
R16  value 10K  [Panasonic ERJ-Series (1608)]
R17  value 10K  [Panasonic ERJ-Series (1608)]
R18  value 10K  [Panasonic ERJ-Series (1608)]
R19  value 10K  [Panasonic ERJ-Series (1608)]
R20  value 10K  [Panasonic ERJ-Series (1608)]
R21  value 10K  [Panasonic ERJ-Series (1608)]
R22  value 10K  [Panasonic ERJ-Series (1608)]
R23  value 10K  [Panasonic ERJ-Series (1608)]
R24  value 10K  [Panasonic ERJ-Series (1608)]
R25  value 10K  [Panasonic ERJ-Series (1608)]
R26  value 10K  [Panasonic ERJ-Series (1608)]
R27  value 10K  [Panasonic ERJ-Series (1608)]
R28  value 10K  [Panasonic ERJ-Series (1608)]
R29  value 10K  [Panasonic ERJ-Series (1608)]
R30  value 10K  [Panasonic ERJ-Series (1608)]
R31  value 10K  [Panasonic ERJ-Series (1608)]
R32  value 10K  [Panasonic ERJ-Series (1608)]
R33  value 10K  [Panasonic ERJ-Series (1608)]
R34  value 10K  [Panasonic ERJ-Series (1608)]
R35  value 10K  [Panasonic ERJ-Series (1608)]
R36  value 10K  [Panasonic ERJ-Series (1608)]
R37  value 10K  [Panasonic ERJ-Series (1608)]
R38  value 10K  [Panasonic ERJ-Series (1608)]
R39  value 10K  [Panasonic ERJ-Series (1608)]
R40  value 10K  [Panasonic ERJ-Series (1608)]
R41  value 10K  [Panasonic ERJ-Series (1608)]
R42  value 10K  [Panasonic ERJ-Series (1608)]
R43  value 10K  [Panasonic ERJ-Series (1608)]
R44  value 10K  [Panasonic ERJ-Series (1608)]
R45  value 10K  [Panasonic ERJ-Series (1608)]
R46  value 10K  [Panasonic ERJ-Series (1608)]
R47  value 10K  [Panasonic ERJ-Series (1608)]
R48  value 10K  [Panasonic ERJ-Series (1608)]
R49  value 10K  [Panasonic ERJ-Series (1608)]
R50  value 10K  [Panasonic ERJ-Series (1608)]
R51  value 10K  [Panasonic ERJ-Series (1608)]
R52  value 10K  [Panasonic ERJ-Series (1608)]
R53  value 10K  [Panasonic ERJ-Series (1608)]
R54  value 10K  [Panasonic ERJ-Series (1608)]
R55  value 10K  [Panasonic ERJ-Series (1608)]
R56  value 10K  [Panasonic ERJ-Series (1608)]
R57  value 10K  [Panasonic ERJ-Series (1608)]
R58  value 10K  [Panasonic ERJ-Series (1608)]
R59  value 10K  [Panasonic ERJ-Series (1608)]
R60  value 10K  [Panasonic ERJ-Series (1608)]
R61  value 10K  [Panasonic ERJ-Series (1608)]
R62  value 10K  [Panasonic ERJ-Series (1608)]
R63  value 10K  [Panasonic ERJ-Series (1608)]
R64  value 10K  [Panasonic ERJ-Series (1608)]
R65  value 10K  [Panasonic ERJ-Series (1608)]
R66  value 10K  [Panasonic ERJ-Series (1608)]
R67  value 10K  [Panasonic ERJ-Series (1608)]
U12  MC74VHCT50A  (value not drawn)
U13  MC74VHCT50A  (value not drawn)
U14  MC74VHCT50A  (value not drawn)
U15  MC74VHCT50A  (value not drawn)
U16  MC74VHCT50A  (value not drawn)
U17  MC74VHCT50A  (value not drawn)

### Nets
+3.3VD: C19.2 C20.2 C21.2 C22.2 C23.2 C24.2 U12.14(Vcc) U13.14(Vcc) U14.14(Vcc) U15.14(Vcc) U16.14(Vcc) U17.14(Vcc)
GND: C19.1 C20.1 C21.1 C22.1 C23.1 C24.1 Q1.3(S) Q2.3(S) Q3.3(S) Q4.3(S) Q5.3(S) Q6.3(S) Q7.3(S) Q8.3(S) Q9.3(S) Q10.3(S) Q11.3(S) Q12.3(S) Q13.3(S) Q14.3(S) Q15.3(S) Q16.3(S) Q17.3(S) Q18.3(S) Q19.3(S) Q20.3(S) Q21.3(S) Q22.3(S) Q23.3(S) Q24.3(S) Q25.3(S) Q26.3(S) Q27.3(S) Q28.3(S) Q29.3(S) Q30.3(S) Q31.3(S) Q32.3(S) Q33.3(S) Q34.3(S) Q35.3(S) Q36.3(S) Q37.3(S) Q38.3(S) Q39.3(S) Q40.3(S) Q41.3(S) Q42.3(S) Q43.3(S) Q44.3(S) Q45.3(S) Q46.3(S) Q47.3(S) Q48.3(S) Q49.3(S) Q50.3(S) Q51.3(S) Q52.3(S) Q53.3(S) Q54.3(S) R14.1 R15.1 R16.1 R17.1 R18.1 R19.1 R20.1 R21.1 R22.1 R23.1 R24.1 R25.1 R26.1 R27.1 R28.1 R29.1 R30.1 R31.1 R32.1 R33.1 R34.1 R35.1 R36.1 R37.1 R38.1 R39.1 R40.1 R41.1 R42.1 R43.1 R44.1 R45.1 R46.1 R47.1 R48.1 R49.1 R50.1 R51.1 R52.1 R53.1 R54.1 R55.1 R56.1 R57.1 R58.1 R59.1 R60.1 R61.1 R62.1 R63.1 R64.1 R65.1 R66.1 R67.1 U12.7(GND) U13.7(GND) U14.7(GND) U15.7(GND) U16.7(GND) U17.7(GND)
D1.1.E.1: D22.1(A)
D1.1.E.2: D23.1(A)
D1.1.F.1: D20.1(A)
D1.1.F.2: D21.1(A)
D1.2.E.1: D26.1(A)
D1.2.E.2: D27.1(A)
D1.2.F.1: D24.1(A)
D1.2.F.2: D25.1(A)
D1.3.E.1: D31.1(A)
D1.3.E.2: D32.1(A)
D1.3.E.3: D33.1(A)
D1.3.F.1: D28.1(A)
D1.3.F.2: D29.1(A)
D1.3.F.3: D30.1(A)
D1.AB.1: D34.1(A)
D1.AB.2: D35.1(A)
D1.AD.1: D36.1(A)
D1.AD.2: D37.1(A)
D2.1.E: D39.1(A)
D2.1.F: D38.1(A)
D2.2.E: D41.1(A)
D2.2.F: D40.1(A)
D2.3.E.1: D44.1(A)
D2.3.E.2: D45.1(A)
D2.3.F.1: D42.1(A)
D2.3.F.2: D43.1(A)
D2.AB: D46.1(A)
D2.AD: D47.1(A)
D3.1.E: D49.1(A)
D3.1.F: D48.1(A)
D3.2.E: D51.1(A)
D3.2.F: D50.1(A)
D3.3.E.1: D54.1(A)
D3.3.E.2: D55.1(A)
D3.3.F.1: D52.1(A)
D3.3.F.2: D53.1(A)
D4.1.E: D57.1(A)
D4.1.F: D56.1(A)
D4.2.E: D59.1(A)
D4.2.F: D58.1(A)
D4.3.E.1: D62.1(A)
D4.3.E.2: D63.1(A)
D4.3.F.1: D60.1(A)
D4.3.F.2: D61.1(A)
D4.AB: D64.1(A)
D4.AD: D65.1(A)
D5.1.E: D67.1(A)
D5.1.F: D66.1(A)
D5.2.E: D69.1(A)
D5.2.F: D68.1(A)
D5.3.E: D71.1(A)
D5.3.F: D70.1(A)
D5.AB: D72.1(A)
D5.AD: D73.1(A)
G1.1.E.1: Q3.2(G) Q4.2(G) R14.2 R15.2 U12.4(Y2)  [also labelled G1.1.E.2]
G1.1.F.1: Q1.2(G) Q2.2(G) R66.2 R67.2 U12.2(Y1)  [also labelled G1.1.F.2]
G1.2.E.1: Q7.2(G) Q8.2(G) R18.2 R19.2 U12.12(Y6)  [also labelled G1.2.E.2]
G1.2.F.1: Q5.2(G) Q6.2(G) R16.2 R17.2 U12.6(Y3)  [also labelled G1.2.F.2]
G1.3.E.1: Q12.2(G) Q13.2(G) Q14.2(G) R23.2 R24.2 R25.2 U12.8(Y4)  [also labelled G1.3.E.2, G1.3.E.3]
G1.3.F.1: Q9.2(G) Q10.2(G) Q11.2(G) R20.2 R21.2 R22.2 U12.10(Y5)  [also labelled G1.3.F.2, G1.3.F.3]
G1.AB.1: Q15.2(G) Q16.2(G) R26.2 R27.2 U13.2(Y1)  [also labelled G1.AB.2]
G1.AD.1: Q17.2(G) Q18.2(G) R28.2 R29.2 U13.4(Y2)  [also labelled G1.AD.2]
G2.1.AD: Q28.2(G) R39.2 U14.12(Y6)
G2.1.E: Q20.2(G) R31.2 U13.12(Y6)
G2.1.F: Q19.2(G) R30.2 U13.6(Y3)
G2.2.E: Q22.2(G) R33.2 U13.8(Y4)
G2.2.F: Q21.2(G) R32.2 U13.10(Y5)
G2.3.E.1: Q25.2(G) Q26.2(G) R36.2 R37.2 U14.4(Y2)  [also labelled G2.3.E.2]
G2.3.F.1: Q23.2(G) Q24.2(G) R34.2 R35.2 U14.2(Y1)  [also labelled G2.3.F.2]
G2.AB: Q27.2(G) R38.2 U14.6(Y3)
G3.1.E: Q30.2(G) R41.2 U14.8(Y4)
G3.1.F: Q29.2(G) R40.2 U14.10(Y5)
G3.2.E: Q32.2(G) R47.2 U15.12(Y6)
G3.2.F: Q31.2(G) R46.2 U15.6(Y3)
G3.3.E.1: Q35.2(G) Q36.2(G) R44.2 R45.2 U15.4(Y2)  [also labelled G3.3.E.2]
G4.1.E: Q38.2(G) R49.2 U15.8(Y4)
G4.1.F: Q37.2(G) R48.2 U15.10(Y5)
G4.2.E: Q40.2(G) R55.2 U16.12(Y6)
G4.2.F: Q39.2(G) R54.2 U16.6(Y3)
G4.3.E.1: Q43.2(G) Q44.2(G) R52.2 R53.2 U16.4(Y2)  [also labelled G4.3.E.2]
G4.AB: Q45.2(G) R56.2 U16.10(Y5)
G4.AD: Q46.2(G) R57.2 U16.8(Y4)
G5.1.E: Q48.2(G) R59.2 U17.4(Y2)
G5.1.F: Q47.2(G) R58.2 U17.2(Y1)
G5.2.E: Q50.2(G) R61.2 U17.12(Y6)
G5.2.F: Q49.2(G) R60.2 U17.6(Y3)
G5.3.E: Q52.2(G) R63.2 U17.8(Y4)
G5.3.F: Q51.2(G) R62.2 U17.10(Y5)
G5.AB: Q53.2(G) R64.2
G5.AD: Q54.2(G) R65.2
G.3.3.F.1: Q33.2(G) Q34.2(G) R42.2 R43.2 U15.2(Y1)  [also labelled G3.3.F.2]
G.4.3.F.1: Q41.2(G) Q42.2(G) R50.2 R51.2 U16.2(Y1)  [also labelled G4.3.F.2]
O1.1.E: U12.3(A2)
O1.1.F: U12.1(A1)
O1.2.E: U12.13(A6)
O1.2.F: U12.5(A3)
O1.3.E: U12.9(A4)
O1.3.F: U12.11(A5)
O1.AB: U13.1(A1)
O1.AD: U13.3(A2)
O2.1.E: U13.13(A6)
O2.1.F: U13.5(A3)
O2.2.E: U13.9(A4)
O2.2.F: U13.11(A5)
O2.3.E: U14.3(A2)
O2.3.F: U14.1(A1)
O2.AB: U14.5(A3)
O2.AD: U14.13(A6)
O3.1.E: U14.9(A4)
O3.1.F: U14.11(A5)
O3.2.E: U15.13(A6)
O3.2.F: U15.5(A3)
O3.3.E: U15.3(A2)
O3.3.F: U15.1(A1)
O4.1.E: U15.9(A4)
O4.1.F: U15.11(A5)
O4.2.E: U16.13(A6)
O4.2.F: U16.5(A3)
O4.3.E: U16.3(A2)
O4.3.F: U16.1(A1)
O4.AB: U16.11(A5)
O4.AD: U16.9(A4)
O5.1.E: U17.3(A2)
O5.1.F: U17.1(A1)
O5.2.E: U17.13(A6)
O5.2.F: U17.5(A3)
O5.3.E: U17.9(A4)
O5.3.F: U17.11(A5)
NetD20_2: D20.2(K) Q1.1(D)
NetD21_2: D21.2(K) Q2.1(D)
NetD22_2: D22.2(K) Q3.1(D)
NetD23_2: D23.2(K) Q4.1(D)
NetD24_2: D24.2(K) Q5.1(D)
NetD25_2: D25.2(K) Q6.1(D)
NetD26_2: D26.2(K) Q7.1(D)
NetD27_2: D27.2(K) Q8.1(D)
NetD28_2: D28.2(K) Q9.1(D)
NetD29_2: D29.2(K) Q10.1(D)
NetD30_2: D30.2(K) Q11.1(D)
NetD31_2: D31.2(K) Q12.1(D)
NetD32_2: D32.2(K) Q13.1(D)
NetD33_2: D33.2(K) Q14.1(D)
NetD34_2: D34.2(K) Q15.1(D)
NetD35_2: D35.2(K) Q16.1(D)
NetD36_2: D36.2(K) Q17.1(D)
NetD37_2: D37.2(K) Q18.1(D)
NetD38_2: D38.2(K) Q19.1(D)
NetD39_2: D39.2(K) Q20.1(D)
NetD40_2: D40.2(K) Q21.1(D)
NetD41_2: D41.2(K) Q22.1(D)
NetD42_2: D42.2(K) Q23.1(D)
NetD43_2: D43.2(K) Q24.1(D)
NetD44_2: D44.2(K) Q25.1(D)
NetD45_2: D45.2(K) Q26.1(D)
NetD46_2: D46.2(K) Q27.1(D)
NetD47_2: D47.2(K) Q28.1(D)
NetD48_2: D48.2(K) Q29.1(D)
NetD49_2: D49.2(K) Q30.1(D)
NetD50_2: D50.2(K) Q31.1(D)
NetD51_2: D51.2(K) Q32.1(D)
NetD52_2: D52.2(K) Q33.1(D)
NetD53_2: D53.2(K) Q34.1(D)
NetD54_2: D54.2(K) Q35.1(D)
NetD55_2: D55.2(K) Q36.1(D)
NetD56_2: D56.2(K) Q37.1(D)
NetD57_2: D57.2(K) Q38.1(D)
NetD58_2: D58.2(K) Q39.1(D)
NetD59_2: D59.2(K) Q40.1(D)
NetD60_2: D60.2(K) Q41.1(D)
NetD61_2: D61.2(K) Q42.1(D)
NetD62_2: D62.2(K) Q43.1(D)
NetD63_2: D63.2(K) Q44.1(D)
NetD64_2: D64.2(K) Q45.1(D)
NetD65_2: D65.2(K) Q46.1(D)
NetD66_2: D66.2(K) Q47.1(D)
NetD67_2: D67.2(K) Q48.1(D)
NetD68_2: D68.2(K) Q49.1(D)
NetD69_2: D69.2(K) Q50.1(D)
NetD70_2: D70.2(K) Q51.1(D)
NetD71_2: D71.2(K) Q52.1(D)
NetD72_2: D72.2(K) Q53.1(D)
NetD73_2: D73.2(K) Q54.1(D)

### Notes on the sheet
- Artus Bionics - Artus Flex - Switching Circuits
- 1
- 2
- A
- Ram Alexiev, Maddie Brown, Vivienne JK

### Library data of the parts
C19-C24 = Cap: Capacitor; Published: 8-Jun-2000; LatestRevisionDate: 17-Jul-2002; LatestRevisionNote: Re-released for DXP Platform.; PackageReference: RAD-0.3; Publisher: Altium Limited; PackageDescription: Radial Cap, Thru-Hole; 2 Leads; 0.3 in Pin Spacing; Supplier 1: Digi-Key; Supplier Part Number 1: 445-5146-1-ND
D20-D73 = Diode: Default Diode; Published: 8-Jun-2000; LatestRevisionDate: 17-Jul-2002; LatestRevisionNote: Re-released for DXP Platform.; PackageVersion: Sep-1996; PackageReference: SMC; Publisher: Altium Limited; PackageDescription: DO-214-AB/SMC; 2 C-Bend Leads; Body 7.9 x 5.9 mm, inc. leads (LxW); Code_JEDEC: DO-214-AB; Supplier 1: Digi-Key; Supplier Part Number 1: 1727-5384-1-ND
Q1-Q54 = MOSFET-N: N-Channel MOSFET; Published: 8-Jun-2000; LatestRevisionDate: 17-Jul-2002; LatestRevisionNote: Re-released for DXP Platform.; PackageVersion: 1995/1996; PackageReference: E3; Publisher: Altium Limited; PackageDescription: TO, Flat Index; 3 In-Line, Axial Leads; Body Dia. 4.6mm; Lead Dia. 0.5 mm (max); Supplier 1: Digi-Key; Supplier 2: Digi-Key; Supplier Part Number 2: DMN3023L-7DICT-ND
R14-R67 = Res2: Resistor; Published: 8-Jun-2000; LatestRevisionDate: 17-Jul-2002; LatestRevisionNote: Re-released for DXP Platform.; PackageReference: AXIAL-0.4; Publisher: Altium Limited; PackageDescription: Axial Device, Thru-Hole; 2 Leads; 0.4 in Pin Spacing; Supplier 1: Digi-Key; Supplier 2: Digi-Key; Supplier Part Number 2: P10.0KHCT-ND
U12-U17 = MC74VHCT50A: 6-Channel CMOS Buffer

## Nets that join several sheets
+3.3VD: FLEX_MCU_CONFIG (17 pins), FLEX_OUTPUT (12 pins)
GND: FLEX_MCU_CONFIG (40 pins), FLEX_OUTPUT (120 pins)
D1.1.E.1: FLEX_MCU_CONFIG (J3.3), FLEX_OUTPUT (D22.1)
D1.1.E.2: FLEX_MCU_CONFIG (J3.4), FLEX_OUTPUT (D23.1)
D1.1.F.1: FLEX_MCU_CONFIG (J3.1), FLEX_OUTPUT (D20.1)
D1.1.F.2: FLEX_MCU_CONFIG (J3.2), FLEX_OUTPUT (D21.1)
D1.2.E.1: FLEX_MCU_CONFIG (J3.7), FLEX_OUTPUT (D26.1)
D1.2.E.2: FLEX_MCU_CONFIG (J3.8), FLEX_OUTPUT (D27.1)
D1.2.F.1: FLEX_MCU_CONFIG (J3.5), FLEX_OUTPUT (D24.1)
D1.2.F.2: FLEX_MCU_CONFIG (J3.6), FLEX_OUTPUT (D25.1)
D1.3.E.1: FLEX_MCU_CONFIG (J4.3), FLEX_OUTPUT (D31.1)
D1.3.E.2: FLEX_MCU_CONFIG (J4.4), FLEX_OUTPUT (D32.1)
D1.3.E.3: FLEX_MCU_CONFIG (J4.5), FLEX_OUTPUT (D33.1)
D1.3.F.1: FLEX_MCU_CONFIG (J3.9), FLEX_OUTPUT (D28.1)
D1.3.F.2: FLEX_MCU_CONFIG (J4.1), FLEX_OUTPUT (D29.1)
D1.3.F.3: FLEX_MCU_CONFIG (J4.2), FLEX_OUTPUT (D30.1)
D1.AB.1: FLEX_MCU_CONFIG (J4.6), FLEX_OUTPUT (D34.1)
D1.AB.2: FLEX_MCU_CONFIG (J4.7), FLEX_OUTPUT (D35.1)
D1.AD.1: FLEX_MCU_CONFIG (J4.8), FLEX_OUTPUT (D36.1)
D1.AD.2: FLEX_MCU_CONFIG (J4.9), FLEX_OUTPUT (D37.1)
D2.1.E: FLEX_MCU_CONFIG (J1.2), FLEX_OUTPUT (D39.1)
D2.1.F: FLEX_MCU_CONFIG (J1.1), FLEX_OUTPUT (D38.1)
D2.2.E: FLEX_MCU_CONFIG (J1.4), FLEX_OUTPUT (D41.1)
D2.2.F: FLEX_MCU_CONFIG (J1.3), FLEX_OUTPUT (D40.1)
D2.3.E.1: FLEX_MCU_CONFIG (J1.7), FLEX_OUTPUT (D44.1)
D2.3.E.2: FLEX_MCU_CONFIG (J1.8), FLEX_OUTPUT (D45.1)
D2.3.F.1: FLEX_MCU_CONFIG (J1.5), FLEX_OUTPUT (D42.1)
D2.3.F.2: FLEX_MCU_CONFIG (J1.6), FLEX_OUTPUT (D43.1)
D2.AB: FLEX_MCU_CONFIG (J1.9), FLEX_OUTPUT (D46.1)
D2.AD: FLEX_MCU_CONFIG (J1.10), FLEX_OUTPUT (D47.1)
D3.1.E: FLEX_MCU_CONFIG (J5.5), FLEX_OUTPUT (D49.1)
D3.1.F: FLEX_MCU_CONFIG (J5.6), FLEX_OUTPUT (D48.1)
D3.2.E: FLEX_MCU_CONFIG (J5.3), FLEX_OUTPUT (D51.1)
D3.2.F: FLEX_MCU_CONFIG (J5.4), FLEX_OUTPUT (D50.1)
D3.3.E.1: FLEX_MCU_CONFIG (J5.8), FLEX_OUTPUT (D54.1)
D3.3.E.2: FLEX_MCU_CONFIG (J5.7), FLEX_OUTPUT (D55.1)
D3.3.F.1: FLEX_MCU_CONFIG (J5.2), FLEX_OUTPUT (D52.1)
D3.3.F.2: FLEX_MCU_CONFIG (J5.1), FLEX_OUTPUT (D53.1)
D4.1.E: FLEX_MCU_CONFIG (J2.3), FLEX_OUTPUT (D57.1)
D4.1.F: FLEX_MCU_CONFIG (J2.2), FLEX_OUTPUT (D56.1)
D4.2.E: FLEX_MCU_CONFIG (J2.5), FLEX_OUTPUT (D59.1)
D4.2.F: FLEX_MCU_CONFIG (J2.4), FLEX_OUTPUT (D58.1)
D4.3.E.1: FLEX_MCU_CONFIG (J2.6), FLEX_OUTPUT (D62.1)
D4.3.E.2: FLEX_MCU_CONFIG (J2.7), FLEX_OUTPUT (D63.1)
D4.3.F.1: FLEX_MCU_CONFIG (J2.8), FLEX_OUTPUT (D60.1)
D4.3.F.2: FLEX_MCU_CONFIG (J2.1), FLEX_OUTPUT (D61.1)
D4.AB: FLEX_MCU_CONFIG (J2.9), FLEX_OUTPUT (D64.1)
D4.AD: FLEX_MCU_CONFIG (J2.10), FLEX_OUTPUT (D65.1)
D5.1.E: FLEX_MCU_CONFIG (J6.2), FLEX_OUTPUT (D67.1)
D5.1.F: FLEX_MCU_CONFIG (J6.1), FLEX_OUTPUT (D66.1)
D5.2.E: FLEX_MCU_CONFIG (J6.4), FLEX_OUTPUT (D69.1)
D5.2.F: FLEX_MCU_CONFIG (J6.3), FLEX_OUTPUT (D68.1)
D5.3.E: FLEX_MCU_CONFIG (J6.6), FLEX_OUTPUT (D71.1)
D5.3.F: FLEX_MCU_CONFIG (J6.5), FLEX_OUTPUT (D70.1)
D5.AB: FLEX_MCU_CONFIG (J6.7), FLEX_OUTPUT (D72.1)
D5.AD: FLEX_MCU_CONFIG (J6.8), FLEX_OUTPUT (D73.1)
G5.AB: FLEX_MCU_CONFIG (U4.10), FLEX_OUTPUT (Q53.2 R64.2)
G5.AD: FLEX_MCU_CONFIG (U4.8), FLEX_OUTPUT (Q54.2 R65.2)
O1.1.E: FLEX_MCU_CONFIG (U1.20), FLEX_OUTPUT (U12.3)
O1.1.F: FLEX_MCU_CONFIG (U1.19), FLEX_OUTPUT (U12.1)
O1.2.E: FLEX_MCU_CONFIG (U1.22), FLEX_OUTPUT (U12.13)
O1.2.F: FLEX_MCU_CONFIG (U1.21), FLEX_OUTPUT (U12.5)
O1.3.E: FLEX_MCU_CONFIG (U1.24), FLEX_OUTPUT (U12.9)
O1.3.F: FLEX_MCU_CONFIG (U1.23), FLEX_OUTPUT (U12.11)
O1.AB: FLEX_MCU_CONFIG (U1.25), FLEX_OUTPUT (U13.1)
O1.AD: FLEX_MCU_CONFIG (U1.26), FLEX_OUTPUT (U13.3)
O2.1.E: FLEX_MCU_CONFIG (U1.28), FLEX_OUTPUT (U13.13)
O2.1.F: FLEX_MCU_CONFIG (U1.27), FLEX_OUTPUT (U13.5)
O2.2.E: FLEX_MCU_CONFIG (U1.30), FLEX_OUTPUT (U13.9)
O2.2.F: FLEX_MCU_CONFIG (U1.29), FLEX_OUTPUT (U13.11)
O2.3.E: FLEX_MCU_CONFIG (U1.34), FLEX_OUTPUT (U14.3)
O2.3.F: FLEX_MCU_CONFIG (U1.33), FLEX_OUTPUT (U14.1)
O2.AB: FLEX_MCU_CONFIG (U1.35), FLEX_OUTPUT (U14.5)
O2.AD: FLEX_MCU_CONFIG (U1.36), FLEX_OUTPUT (U14.13)
O3.1.E: FLEX_MCU_CONFIG (U1.38), FLEX_OUTPUT (U14.9)
O3.1.F: FLEX_MCU_CONFIG (U1.37), FLEX_OUTPUT (U14.11)
O3.2.E: FLEX_MCU_CONFIG (U1.40), FLEX_OUTPUT (U15.13)
O3.2.F: FLEX_MCU_CONFIG (U1.39), FLEX_OUTPUT (U15.5)
O3.3.E: FLEX_MCU_CONFIG (U1.42), FLEX_OUTPUT (U15.3)
O3.3.F: FLEX_MCU_CONFIG (U1.41), FLEX_OUTPUT (U15.1)
O4.1.E: FLEX_MCU_CONFIG (U1.44), FLEX_OUTPUT (U15.9)
O4.1.F: FLEX_MCU_CONFIG (U1.43), FLEX_OUTPUT (U15.11)
O4.2.E: FLEX_MCU_CONFIG (U1.47), FLEX_OUTPUT (U16.13)
O4.2.F: FLEX_MCU_CONFIG (U1.45), FLEX_OUTPUT (U16.5)
O4.3.F: FLEX_MCU_CONFIG (U1.48), FLEX_OUTPUT (U16.1)
O4.AB: FLEX_MCU_CONFIG (U1.50), FLEX_OUTPUT (U16.11)
O4.AD: FLEX_MCU_CONFIG (U1.51), FLEX_OUTPUT (U16.9)
O5.1.E: FLEX_MCU_CONFIG (U1.53), FLEX_OUTPUT (U17.3)
O5.1.F: FLEX_MCU_CONFIG (U1.52), FLEX_OUTPUT (U17.1)
O5.2.E: FLEX_MCU_CONFIG (U1.55), FLEX_OUTPUT (U17.13)
O5.2.F: FLEX_MCU_CONFIG (U1.54), FLEX_OUTPUT (U17.5)
O5.3.E: FLEX_MCU_CONFIG (U1.57), FLEX_OUTPUT (U17.9)
O5.3.F: FLEX_MCU_CONFIG (U1.56), FLEX_OUTPUT (U17.11)